# EasyEDA schematic schematic.json
TITLE: Sheet_1; REV: 1.0; Date: 2024-04-25; Sheet: 1/1; Drawn By: john.tanaristy; Company: Your Company
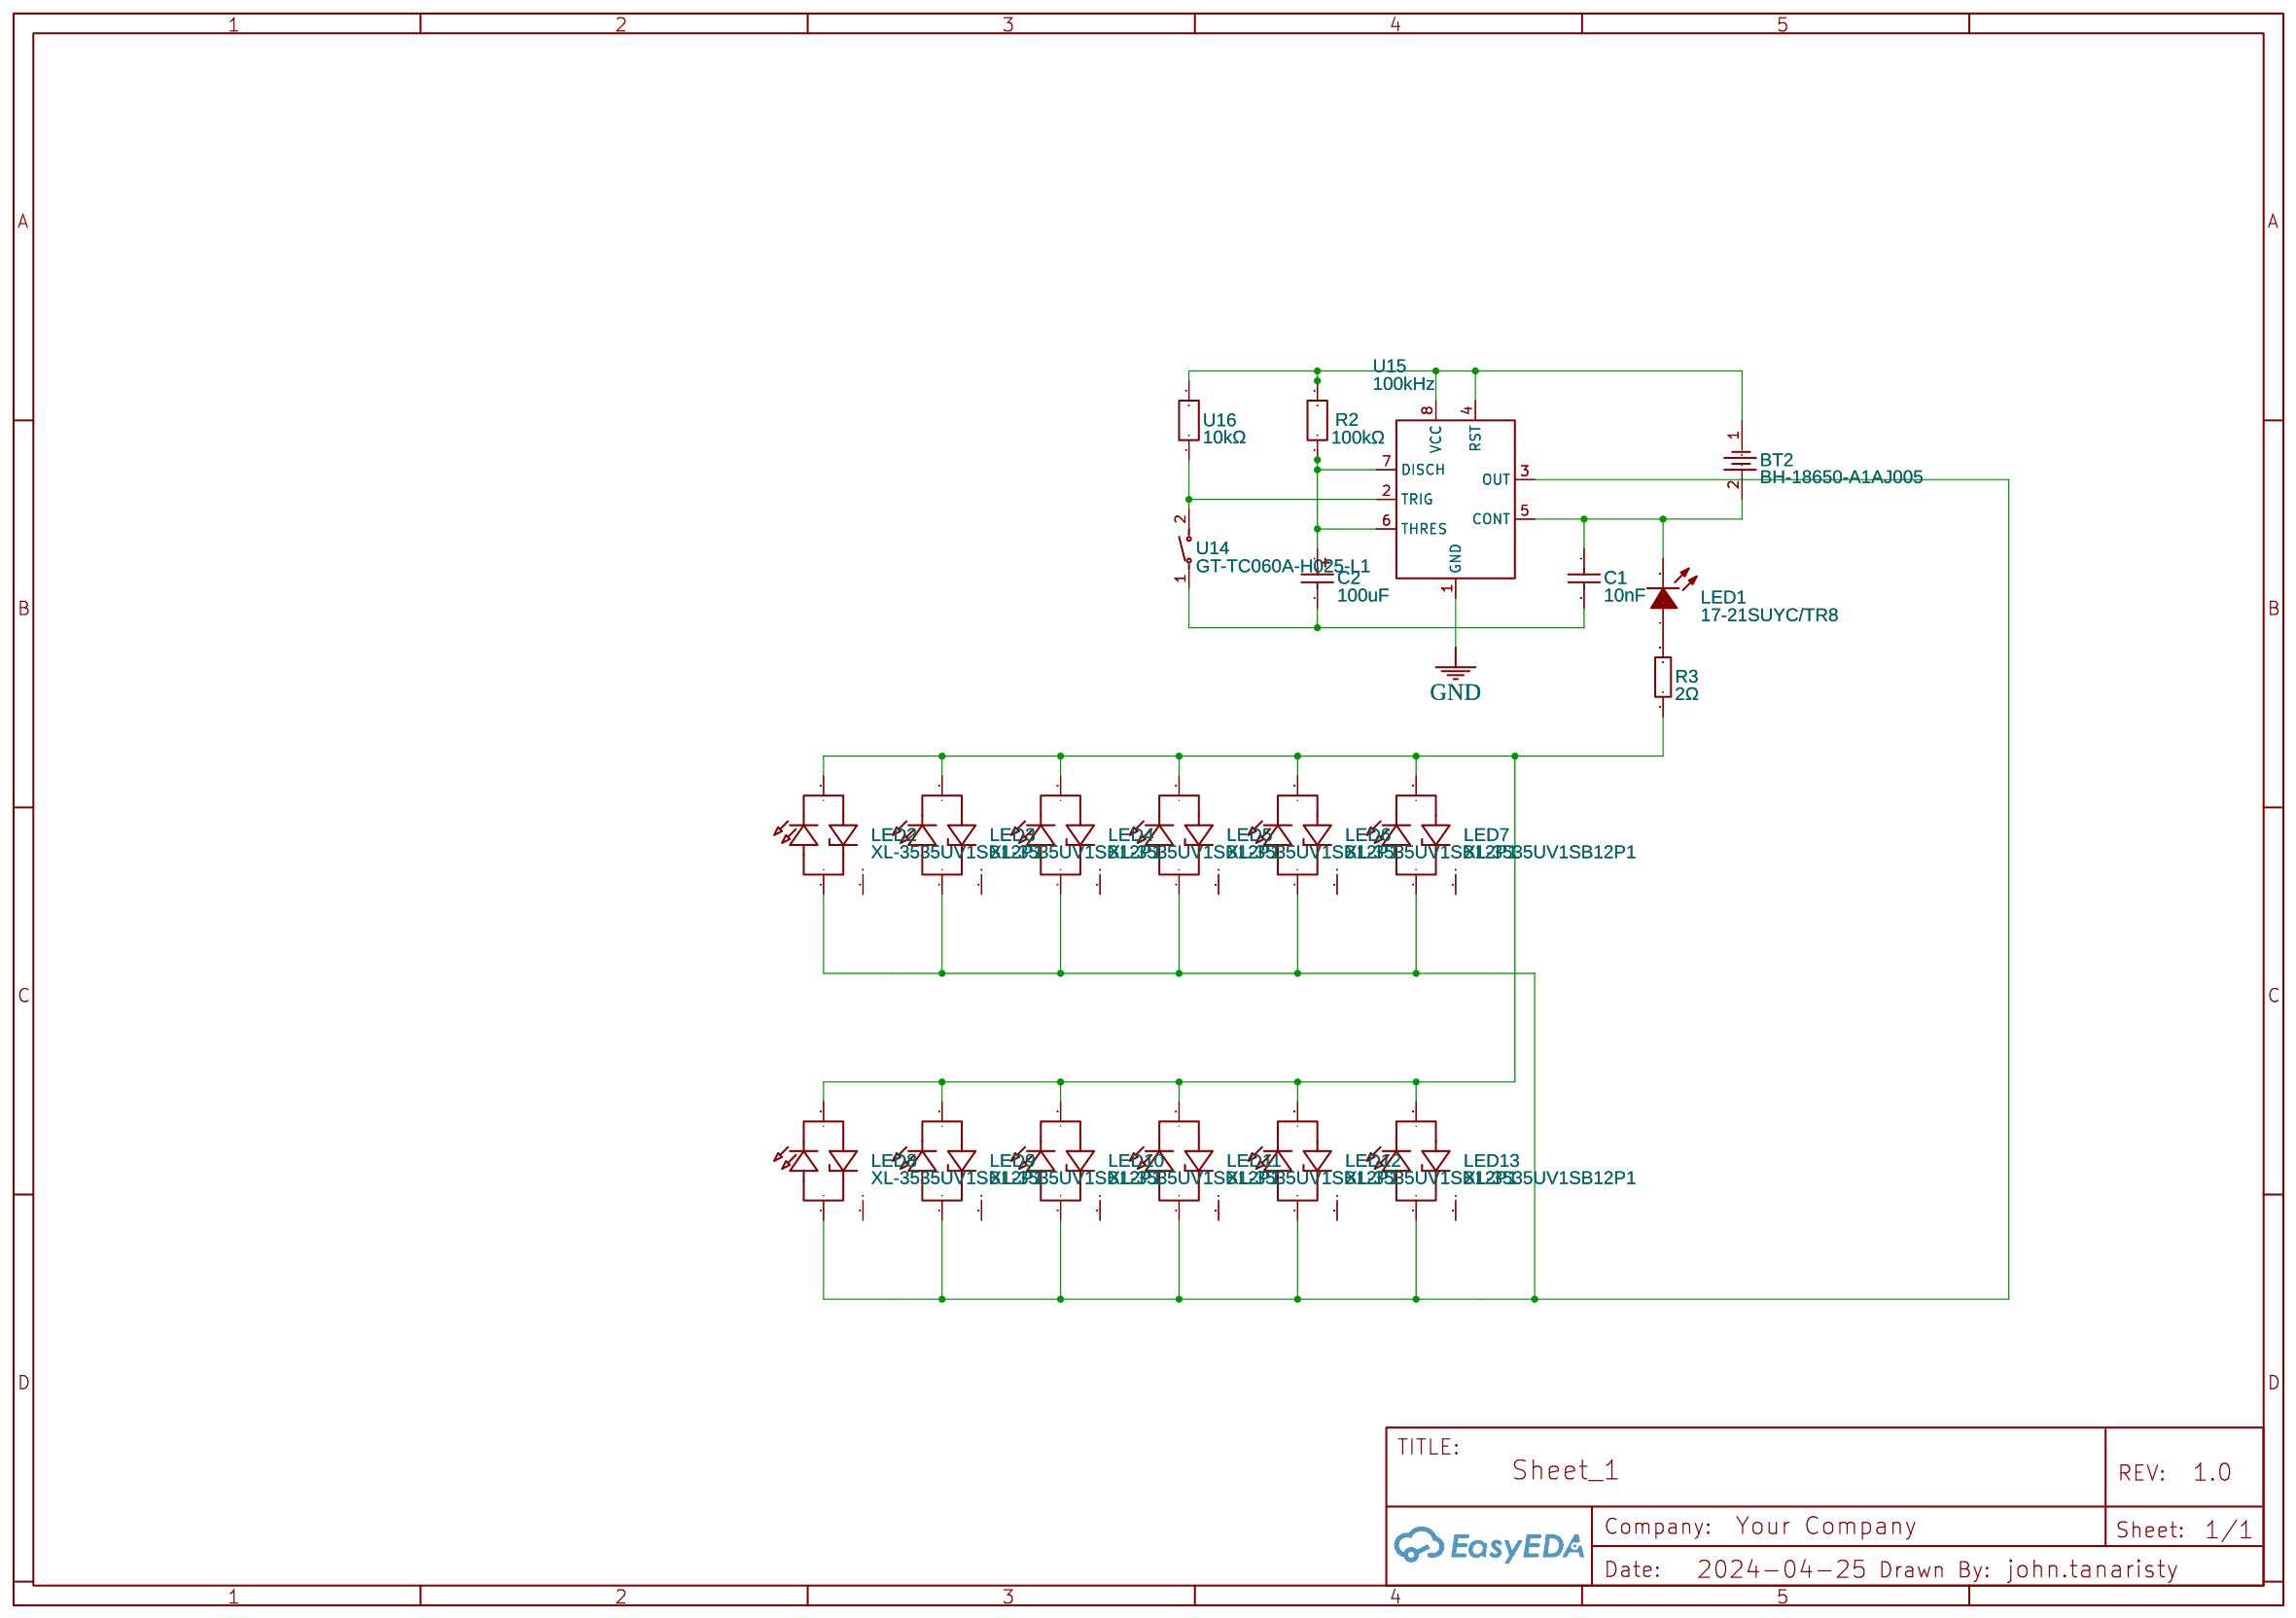
[diagram p0: schematic sheet]

## Parts
BT2  BH-18650-A1AJ005  [BAT-TH_BH-18650-A1AJ005]
C1  10nF  [C0402]
C2  100uF  [CASE-A_3216]
LED1  17-21SUYC/TR8  [LED0805-R-RD]
LED2  XL-3535UV1SB12P1  [LED-SMD_XL-3535UV1SB12P1]
LED3  XL-3535UV1SB12P1  [LED-SMD_XL-3535UV1SB12P1]
LED4  XL-3535UV1SB12P1  [LED-SMD_XL-3535UV1SB12P1]
LED5  XL-3535UV1SB12P1  [LED-SMD_XL-3535UV1SB12P1]
LED6  XL-3535UV1SB12P1  [LED-SMD_XL-3535UV1SB12P1]
LED7  XL-3535UV1SB12P1  [LED-SMD_XL-3535UV1SB12P1]
LED8  XL-3535UV1SB12P1  [LED-SMD_XL-3535UV1SB12P1]
LED9  XL-3535UV1SB12P1  [LED-SMD_XL-3535UV1SB12P1]
LED10  XL-3535UV1SB12P1  [LED-SMD_XL-3535UV1SB12P1]
LED11  XL-3535UV1SB12P1  [LED-SMD_XL-3535UV1SB12P1]
LED12  XL-3535UV1SB12P1  [LED-SMD_XL-3535UV1SB12P1]
LED13  XL-3535UV1SB12P1  [LED-SMD_XL-3535UV1SB12P1]
R2  100kΩ  [R0805]
R3  2Ω  [R0603]
U14  GT-TC060A-H025-L1  [SW-SMD_L6.1-W3.5-LS8.0]
U15  100kHz  [SOIC-8_L4.9-W3.9-P1.27-LS6.0-BL]
U16  10kΩ  [R0603]

## Library data of the parts
BT2 = BH-18650-A1AJ005: Supplier: LCSC; Supplier Part: C5290176; Manufacturer: MYOUNG(美阳); JLCPCB Part Class: Extended Part; Contributor: lcsc
C1 = CC0402KRX7R9BB103: Supplier: LCSC; Manufacturer: YAGEO(国巨); Supplier Part: C60133; JLCPCB Part Class: Extended Part
C2 = TLJA107M006R0800: Supplier: LCSC; Manufacturer: Kyocera AVX; Supplier Part: C27279; JLCPCB Part Class: Extended Part
LED1 = 17-21SUYC/TR8: Supplier: LCSC; Manufacturer: KENTO; Manufacturer Part: KT-0805黄灯; Supplier Part: C2296; JLCPCB Part Class: Basic Part
LED2-LED13 = XL-3535UV1SB12P1: Contributor: LCSC; Supplier: LCSC; Supplier Part: C962563; Manufacturer: XINGLIGHT(成兴光); JLCPCB Part Class: Extended Part
R2 = FRC0805J104 TS: Contributor: lcsc; Supplier: LCSC; Supplier Part: C2907293; Manufacturer: FOJAN(富捷); JLCPCB Part Class: Extended Part
R3 = 0603WAF200KT5E: Supplier: LCSC; Manufacturer: UNI-ROYAL(厚声); Supplier Part: C22977; JLCPCB Part Class: Basic Part
U14 = GT-TC060A-H025-L1: Contributor: lcsc; Supplier: LCSC; Supplier Part: C5117870; Manufacturer: G-Switch(品赞); JLCPCB Part Class: Extended Part
U15 = NE555DR: Supplier: LCSC; Manufacturer: TI(德州仪器); Supplier Part: C7593; JLCPCB Part Class: Extended Part
U16 = ABD03K1002FT: Contributor: lcsc; Supplier: LCSC; Supplier Part: C5139509; Manufacturer: FH(风华); JLCPCB Part Class: Extended Part

## Nets
GND: U15.1(GND)
Net-(BT2-1): BT2.1 R2.2 U15.4(RST) U15.8(VCC) U16.2
Net-(BT2-2): BT2.2 C1.1 LED1.2(-) U15.5(CONT)
Net-(C1-2): C1.2 C2.2 U14.1
Net-(C2-1): C2.1 R2.1 U15.6(THRES) U15.7(DISCH)
Net-(LED1-1): LED1.1(+) R3.2
Net-(LED2-1): LED2.1(+) LED3.1(+) LED4.1(+) LED5.1(+) LED6.1(+) LED7.1(+) LED8.1(+) LED9.1(+) LED10.1(+) LED11.1(+) LED12.1(+) LED13.1(+) U15.3(OUT)
Net-(LED2-2): LED2.2(-) LED3.2(-) LED4.2(-) LED5.2(-) LED6.2(-) LED7.2(-) LED8.2(-) LED9.2(-) LED10.2(-) LED11.2(-) LED12.2(-) LED13.2(-) R3.1
Net-(U14-2): U14.2 U15.2(TRIG) U16.1

Not connected (* = marked no-connect by the designer): LED2 3; LED3 3; LED4 3; LED5 3; LED6 3; LED7 3; LED8 3; LED9 3; LED10 3; LED11 3; LED12 3; LED13 3
